# EAGLE design untitled (EAGLE 8.3.2)
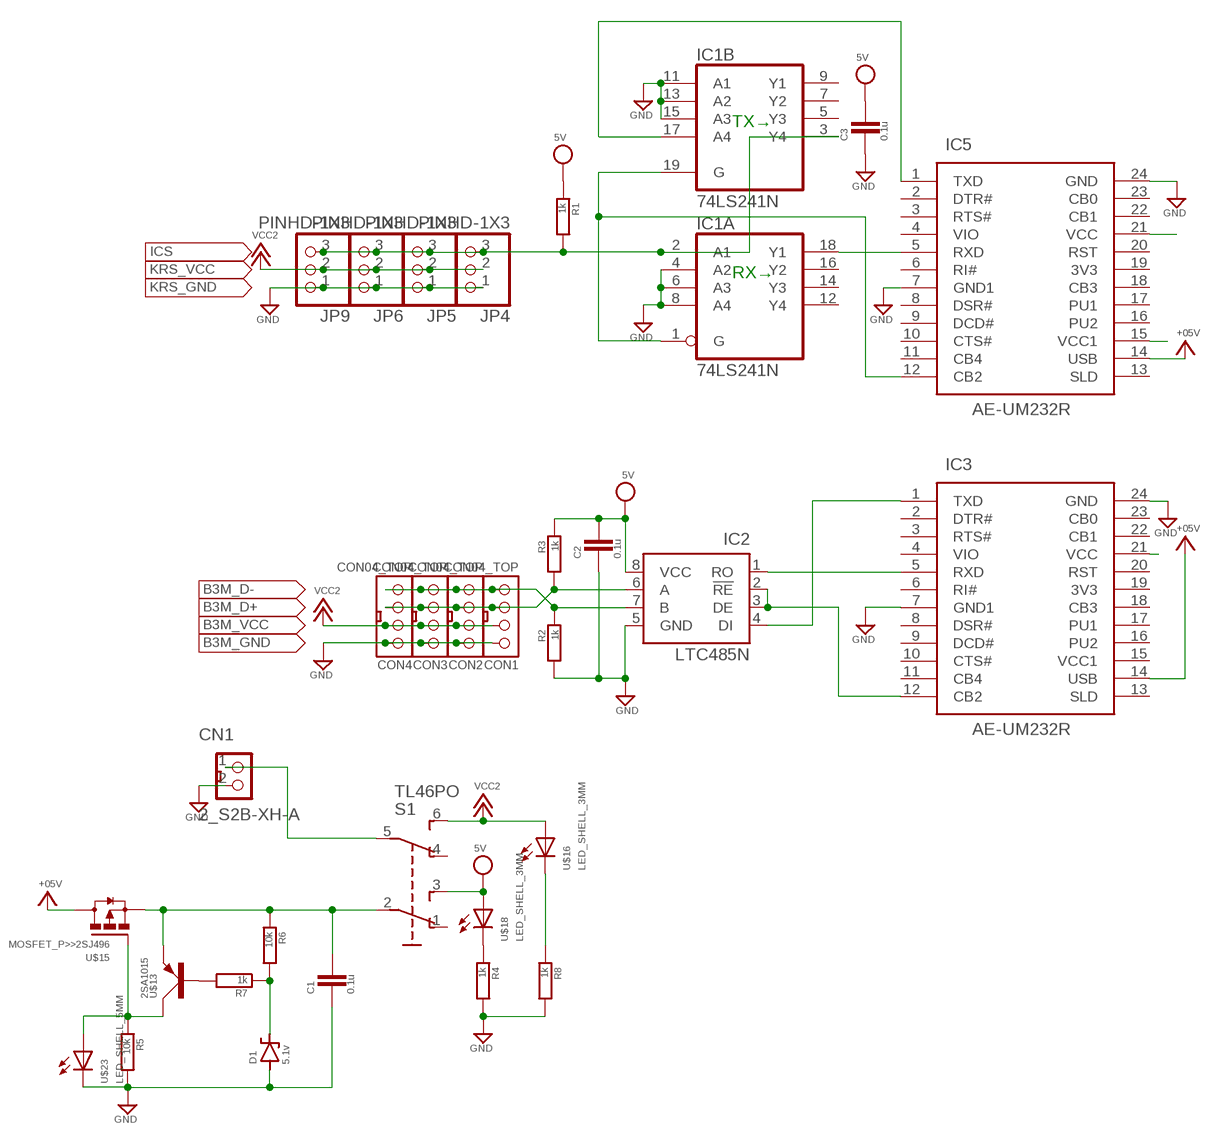
[diagram p0: schematic, sheet 1]

## Parts
C1  0.1u  C>>050-024X044  [C050-024X044]
C2  0.1u  C>>050-024X044  [C050-024X044]
C3  0.1u  C>>050-024X044  [C050-024X044]
CN1  2_S2B-XH-A  [S2B-XH-A]
CON1  CON04_TOP  [TOP_CON4]
CON2  CON04_TOP  [TOP_CON4]
CON3  CON04_TOP  [TOP_CON4]
CON4  CON04_TOP  [TOP_CON4]
D1  5.1v  ZENER-DIODE>>ZD-5  [ZDIO-5]
IC1  74LS241N  [DIL20]
IC2  LTC485N  [DIL08]
IC3  AE-UM232R  [AE-UM232R]
IC5  AE-UM232R  [AE-UM232R]
JP4  PINHD-1X3  [1X03]
JP5  PINHD-1X3  [1X03]
JP6  PINHD-1X3  [1X03]
JP9  PINHD-1X3  [1X03]
R1  1k  R-EU>>1/4W(8MM)  [1/4W(8MM)]
R2  1k  R-EU>>1/4W(8MM)  [1/4W(8MM)]
R3  1k  R-EU>>1/4W(8MM)  [1/4W(8MM)]
R4  1k  R-EU>>1/4W(8MM)  [1/4W(8MM)]
R5  10k  R-EU>>1/4W(8MM)  [1/4W(8MM)]
R6  10k  R-EU>>1/4W(8MM)  [1/4W(8MM)]
R7  1k  R-EU>>1/4W(8MM)  [1/4W(8MM)]
R8  1k  R-EU>>1/4W(8MM)  [1/4W(8MM)]
S1  TL46PO  [TL4XPO]
U$13  2SA1015  TR_PNP>>TO-92  [TO-92]
U$15  MOSFET_P>>2SJ496  [TO-92]
U$16  LED_SHELL_3MM  [3MM]
U$18  LED_SHELL_3MM  [3MM]
U$23  LED_SHELL_5MM  [5MM]

## Nets
+5V: IC3.14(USB) IC5.14(USB) U$15.2(D) ; supply symbol labelled +05V
GND: C1.2 C2.2 C3.2 CN1.2 CON1.P$1 CON2.P$1 CON3.P$1 CON4.P$1 D1.A IC1.4(A:A2) IC1.6(A:A3) IC1.8(A:A4) IC1.11(B:A1) IC1.13(B:A2) IC1.15(B:A3) IC2.5(GND) IC3.7(GND1) IC3.24(GND) IC5.7(GND1) IC5.24(GND) JP4.1 JP5.1 JP6.1 JP9.1 R2.2 R4.2 R5.2 R8.2 U$23.P$2(C)
ICS: IC1.2(A:A1) IC1.3(B:Y4) JP4.3 JP5.3 JP6.3 JP9.3 R1.2
N$1: IC1.18(A:Y1) IC5.5(RXD)
N$2: IC2.4(DI) IC3.1(TXD)
N$3: IC1.1(A:G) IC1.19(B:G) IC5.12(CB2)
N$4: IC5.21(VCC)
N$6: IC5.15(VCC1)
N$7: CN1.1 S1.5(P1)
N$8: C1.1 R6.1 S1.2(P) U$13.1(E) U$15.1(S)
N$9: R5.1 U$13.2(C) U$15.3(G) U$23.P$1(A)
N$10: D1.C R6.2 R7.1
N$11: R7.2 U$13.3(B)
N$13: R8.1 U$16.P$2(C)
N$15: R4.1 U$18.P$2(C)
N$16: IC3.21(VCC)
N$17: CON1.P$4 CON2.P$4 CON3.P$4 CON4.P$4 IC2.7(B) R2.1
N$18: CON1.P$3 CON2.P$3 CON3.P$3 CON4.P$3 IC2.6(A) R3.2
RXD: IC2.1(RO) IC3.5(RXD)
TXD: IC1.17(B:A4) IC5.1(TXD)
TXDEN: IC2.2(!RE) IC2.3(DE) IC3.12(CB2)
VCC: C2.1 C3.1 IC2.8(VCC) R1.1 R3.1 S1.3(S) U$18.P$1(A) ; supply symbol labelled 5V
VCC2: CON1.P$2 CON2.P$2 CON3.P$2 CON4.P$2 JP4.2 JP5.2 JP6.2 JP9.2 S1.6(S1) U$16.P$1(A)
Unconnected: IC1.5(B:Y3) IC1.7(B:Y2) IC1.9(B:Y1) IC1.12(A:Y4) IC1.14(A:Y3) IC1.16(A:Y2) IC3.2(DTR#) IC3.3(RTS#) IC3.4(VIO) IC3.6(RI#) IC3.8(DSR#) IC3.9(DCD#) IC3.10(CTS#) IC3.11(CB4) IC3.13(SLD) IC3.16(PU2) IC3.17(PU1) IC3.18(CB3) IC3.19(3V3) IC3.20(RST) IC3.22(CB1) IC3.23(CB0) IC5.2(DTR#) IC5.3(RTS#) IC5.4(VIO) IC5.6(RI#) IC5.8(DSR#) IC5.9(DCD#) IC5.10(CTS#) IC5.11(CB4) IC5.13(SLD) IC5.16(PU2) IC5.17(PU1) IC5.18(CB3) IC5.19(3V3) IC5.20(RST) IC5.22(CB1) IC5.23(CB0) S1.1(O) S1.4(O1)

## Notes on the sheet
- TX→
- RX→

## Power pins joined to a net without a drawn wire
GND: IC1.10(P:GND)
VCC: IC1.20(P:VCC)
VCC1: IC3.15(VCC1)

## Library data of the parts
C1-C3 = !Capasiter:C>>: CAPACITOR, European symbol
CN1 = !con-xh:2_: Wire-to-Board 2.5mm pitch top mount connector Source: http://www.jst-mfg.com/product/pdf/jpn/XH.pdf http://www.jst-mfg.com/product/detail.php?series=277
CON1-CON4 = !con_XH(XHｺﾈｸﾀ):CON04_: Low insertion connector 4pin
D1 = !diode(ﾀﾞｲｵｰﾄﾞ):ZENER-DIODE>>: Z-Diode
IC1 = 74xx-us:74*241: Octal BUFFER and LINE DRIVER, 3-state
IC2 = linear-technology:LTC485: Low Power RS485 Interface Transceiver Source: http://www.linear.com/pc/downloadDocument.do?navId=H0,C1,C1007,C1017,P2064,D1718; OC_FARNELL: unknown; OC_NEWARK: unknown
IC3 IC5 = !usb-usart:AE-UM232R: FT232RL USB-Serial Converter - AE-UM232R
JP4-JP6 JP9 = !pinhead(ﾋﾟﾝﾍｯﾀﾞ):PINHD-1X3: PIN HEADER
R1-R8 = !Resistor(抵抗):R-EU>>: RESISTOR, European symbol
S1 = switch:TL46PO: TINY SWITCH ON - ON Source: http://www2.produktinfo.conrad.com/datenblaetter/700000-724999/705152-da-01-de-Subminiaturschalter_TL_36YO.pdf
U$13 = !FET_transister_v-reg:TR_PNP>>
U$15 = !other:MOSFET_P>>
U$16 U$18 U$23 = !led:LED_SHELL

## Board
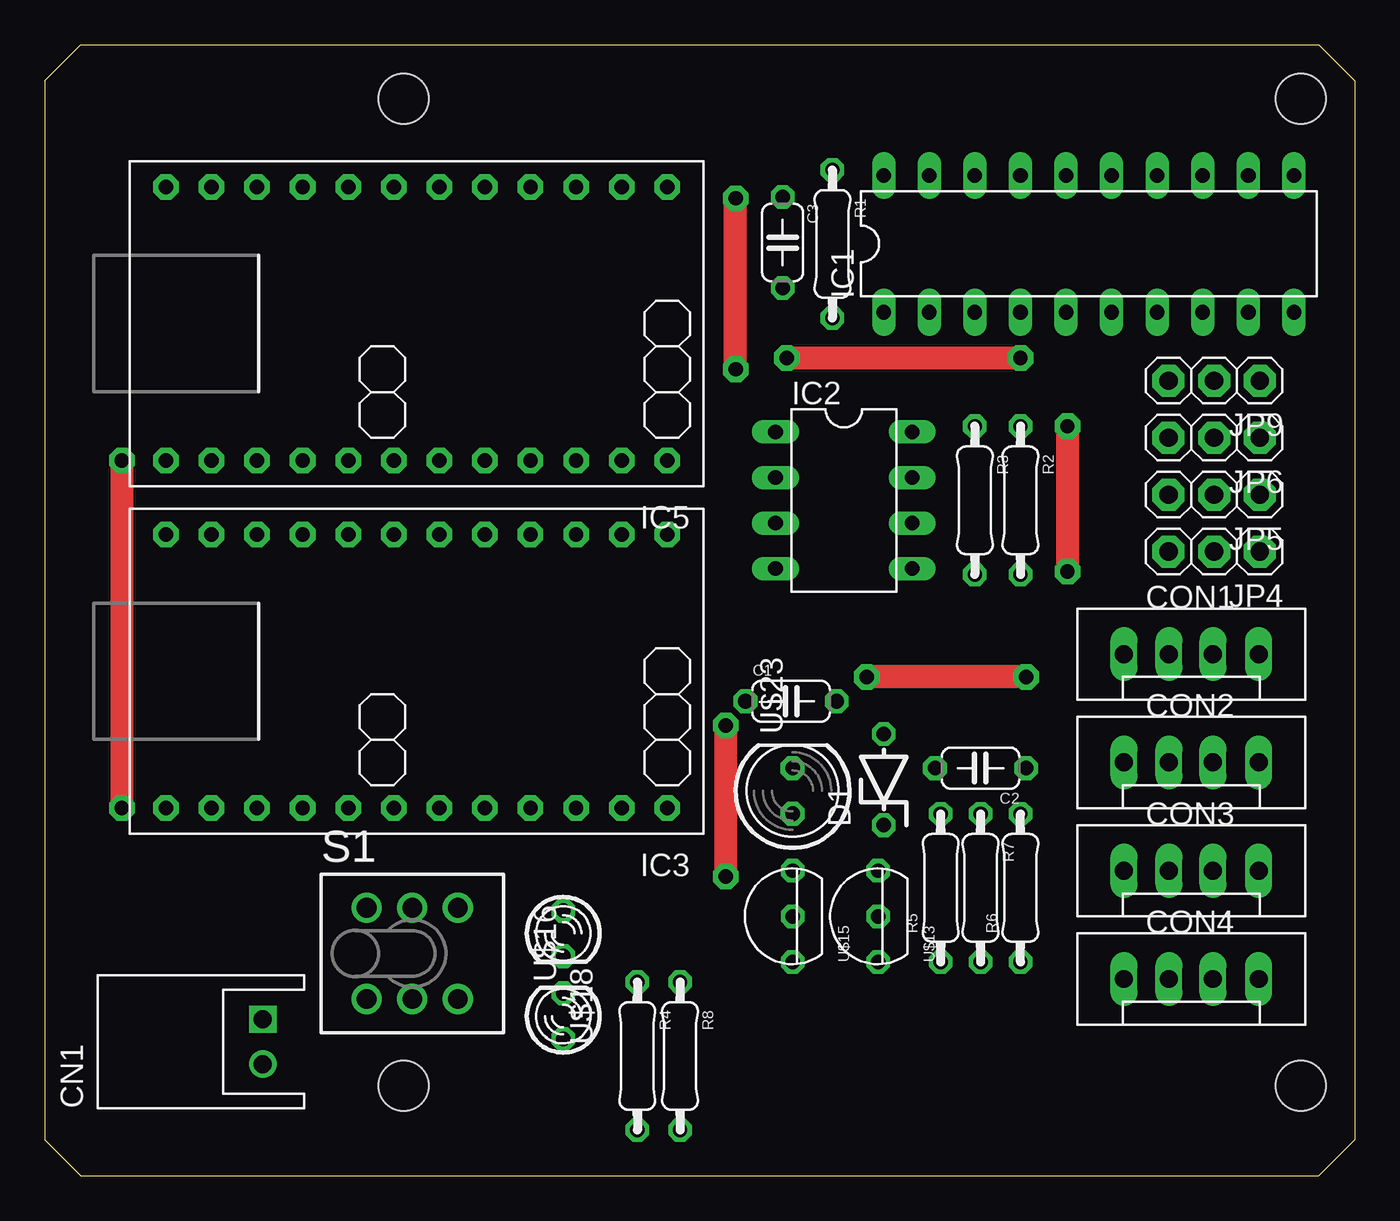
[diagram p1: board, top side]
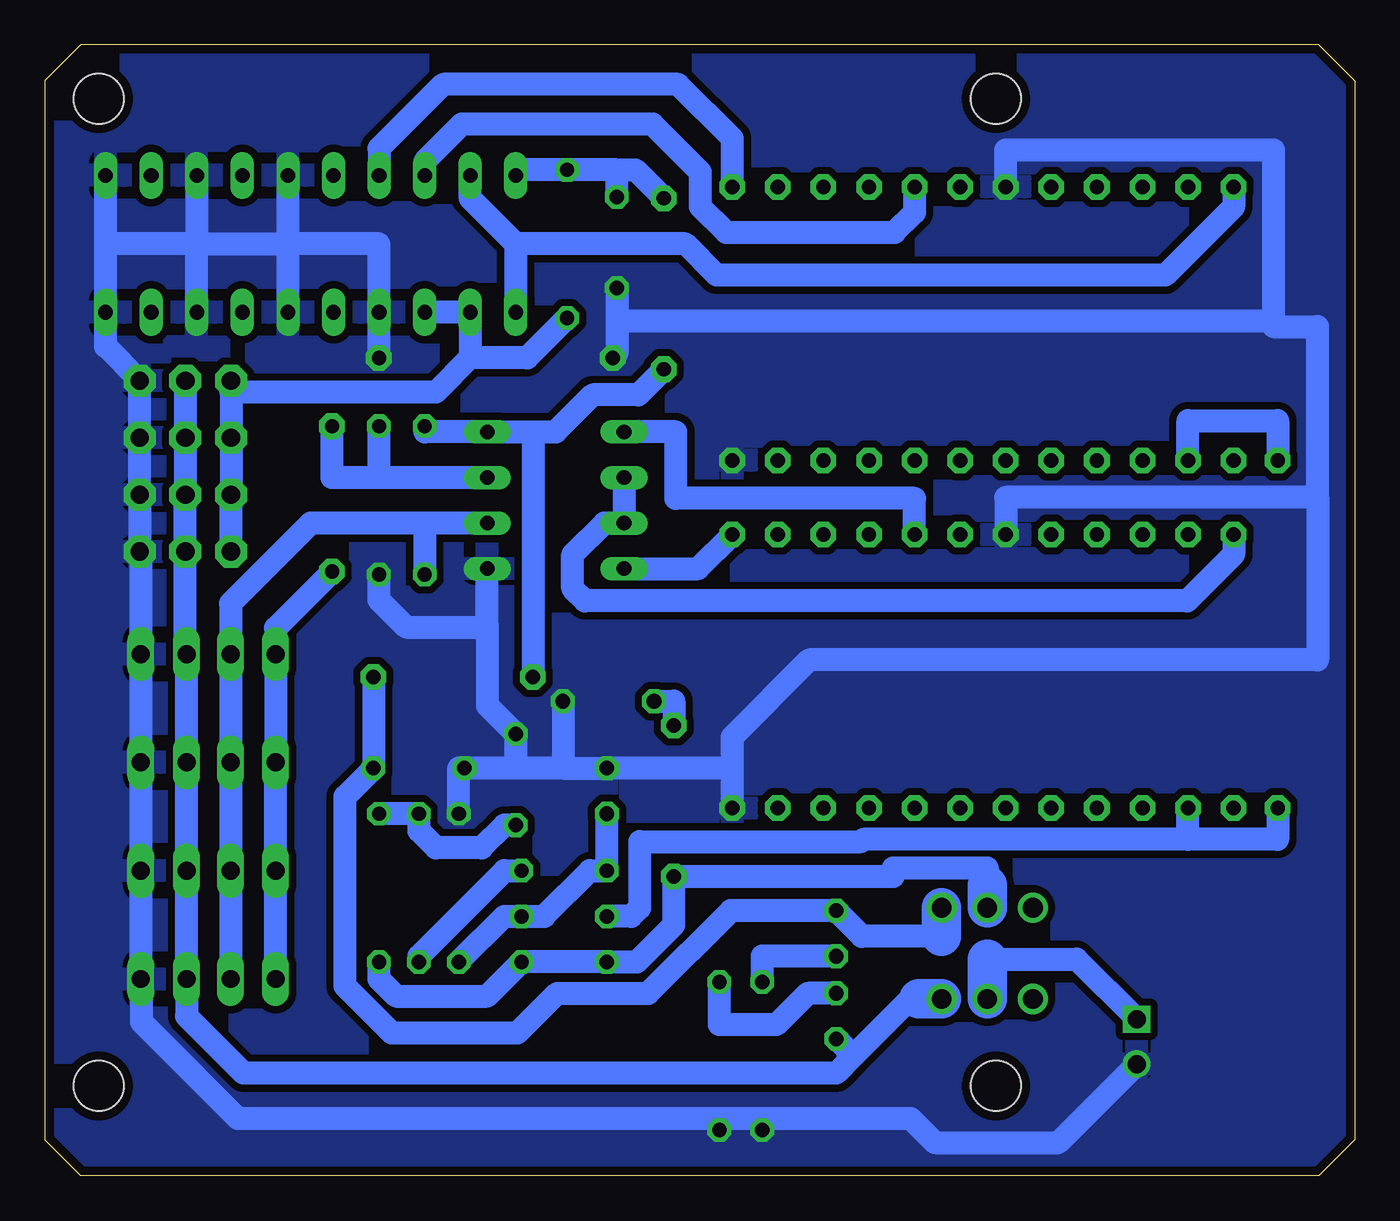
[diagram p2: board, bottom side, seen from below]

Size 73 x 63 mm. Coordinates in mm from the lower left corner, seen from the top.
Outline: 2,63 71,63 73,61 73,2 71,0 2,0 0,2 0,61 2,63
Copper layers (1*16): Top 0.035mm / dielectric 1.5mm / Bottom 0.035mm
Design rules "default *": minimum track width 24mil, minimum drill 0.8mm, track to track 8mil, track to pad 8mil, pad to pad 8mil, via to via 8mil, smd to smd 8mil, copper to edge 0.5mm, drill to drill 8mil, minimum pad ring 10mil, minimum via ring 8mil, stop-mask expansion 4mil, vias tented up to drill 0mil, thermal gap 10mil
Holes 2.8 mm at 20,5 70,5 20,60 70,60

### Footprints (pad centres in the part's own frame; a part is rotated, then mirrored left to right if it is on the bottom)
C050-024X044 = drill 0.813 octagon: 1 -2.54,0; 2 2.54,0
S2B-XH-A = drill 1.016 square: 1 1.25,0 | drill 1.016: 2 -1.25,0
TOP_CON4 = drill 1 long: P$1 3.75,0; P$2 1.2,0; P$3 -1.25,0; P$4 -3.75,0
ZDIO-5 = drill 0.813 octagon: A 2.54,0; C -2.54,0
DIL20 = drill 0.813 long: 1 -11.43,-3.81; 2 -8.89,-3.81; 3 -6.35,-3.81; 4 -3.81,-3.81; 5 -1.27,-3.81; 6 1.27,-3.81; 7 3.81,-3.81; 8 6.35,-3.81; 9 8.89,-3.81; 10 11.43,-3.81; 11 11.43,3.81; 12 8.89,3.81; 13 6.35,3.81; 14 3.81,3.81; 15 1.27,3.81; 16 -1.27,3.81; 17 -3.81,3.81; 18 -6.35,3.81; 19 -8.89,3.81; 20 -11.43,3.81
DIL08 = drill 0.813 long: 1 -3.81,-3.81; 2 -1.27,-3.81; 3 1.27,-3.81; 4 3.81,-3.81; 5 3.81,3.81; 6 1.27,3.81; 7 -1.27,3.81; 8 -3.81,3.81
AE-UM232R = drill 0.8 pad 1.422 octagon: 1 -13.97,-7.62; 2 -11.43,-7.62; 3 -8.89,-7.62; 4 -6.35,-7.62; 5 -3.81,-7.62; 6 -1.27,-7.62; 7 1.27,-7.62; 8 3.81,-7.62; 9 6.35,-7.62; 10 8.89,-7.62; 11 11.43,-7.62; 12 13.97,-7.62; 13 13.97,7.62; 14 11.43,7.62; 15 8.89,7.62; 16 6.35,7.62; 17 3.81,7.62; 18 1.27,7.62; 19 -1.27,7.62; 20 -3.81,7.62; 21 -6.35,7.62; 22 -8.89,7.62; 23 -11.43,7.62; 24 -13.97,7.62
1X03 = drill 1.016 pad 1.778 octagon: 1 -2.54,0; 2 0,0; 3 2.54,0
1/4W(8MM) = drill 0.8 pad 1.27 octagon: 1 -4.128,0; 2 4.128,0
TL4XPO = drill 1.1 pad 1.676: 1 -2.54,2.54; 2 0,2.54; 3 2.54,2.54; 4 -2.54,-2.54; 5 0,-2.54; 6 2.54,-2.54
TO-92 = drill 0.8 octagon: 1 -2.54,0; 2 0,0; 3 2.54,0
3MM = drill 0.813 octagon: P$1 -1.27,0; P$2 1.27,0
5MM = drill 0.813 octagon: P$1 -1.27,0; P$2 1.27,0

### Placement (x,y rotation side)
C1  41.59,26.43 0 top
C2  52.15,22.7 180 top
C3  41.12,51.99 270 top
CN1  12.14,7.46 90 top
CON1  63.9,29.05 0 top
CON2  63.9,23.02 0 top
CON3  63.9,16.99 0 top
CON4  63.9,10.96 0 top
D1  46.75,22.07 90 top
IC1  58.18,51.91 0 top
IC2  44.53,37.62 270 top
IC3  20.72,28.1 180 top
IC5  20.72,47.47 180 top
JP4  65.17,34.77 180 top
JP5  65.17,37.94 180 top
JP6  65.17,41.12 180 top
JP9  65.17,44.29 180 top
R1  43.9,51.91 270 top
R2  54.37,37.62 270 top
R3  51.83,37.62 270 top
R4  33.02,6.67 270 top
R5  49.93,16.04 90 top
R6  54.37,16.04 90 top
R7  52.15,16.04 270 top
R8  35.4,6.67 270 top
S1  20.48,12.38 0 top
U$13  46.44,14.45 90 top
U$15  41.67,14.45 90 top
U$16  28.89,8.89 90 top
U$18  28.89,13.49 270 top
U$23  41.67,21.43 90 top

### Tracks (layer width: path | path; a pad name or v marks a point on that pad's centre or on a via)
+5V  (via drill 0.8 pad 1.42)
  Top 1.27: v4.29,39.85 v4.29,20.48
  Bottom 1.27: U$15.2 40.32,14.45 39.85,14.92 39.85,18.61 27.5,18.61 27.39,18.73 9.29,18.73 | 9.29,18.73 IC3.14 | IC5.14 9.29,42.07 4.29,42.07 v4.29,39.85 | v4.29,20.48 4.29,18.73 9.29,18.73
GND  (via drill 0.8 pad 1.42)
  Top 1.27: v41.35,45.56 v54.37,45.56
  Bottom 1.27: 44.13,22.7 C2.2 | 44.13,22.7 U$23.P$2 34.69,22.7 | 59.45,51.91 54.37,51.91 IC1.4 v54.37,45.56 | 59.45,51.91 IC1.15 | 64.53,51.91 69.61,51.91 | 69.61,51.91 IC1.11 | 69.61,51.91 IC1.10 69.61,46.2 JP9.1 JP6.1 JP5.1 JP4.1 67.65,34.71 CON1.P$1 CON2.P$1 CON3.P$1 CON4.P$1 67.63,10.94 67.63,8.57 62.23,3.17 35.4,3.17 | IC1.6 59.45,51.91 | IC1.13 64.53,51.91 | IC1.8 64.53,51.91 | 64.53,51.91 59.45,51.91 | R2.2 54.37,32.07 52.87,30.56 48.42,30.56 48.34,30.64 | R5.2 49.93,22.7 C2.2 | C2.2 46.75,22.7 D1.A 48.34,26.2 48.34,30.64 | IC3.7 19.45,37.78 2.06,37.78 | 48.34,30.64 IC2.5 | 33.02,3.17 24.74,3.17 23.4,1.84 16.52,1.84 CN1.2 | 33.02,3.17 35.4,3.17 | 34.69,22.7 34.69,24.45 30.4,28.73 2.06,28.73 2.06,37.78 | 35.4,3.17 R8.2 | 33.02,3.17 R4.2 | C3.2 41.12,45.8 v41.35,45.56 | C1.2 44.13,22.7 | IC5.7 19.45,57.15 4.53,57.15 4.53,47.62 | IC3.24 34.69,22.7 | 4.53,47.62 4.53,47.31 2.06,47.31 2.06,37.78 | 40.72,47.62 4.53,47.62
  pour Bottom (isolate 0.406): -4.13,70.96 76.36,70.96 76.68,-2.86 -3.81,-2.86
ICS
  Bottom 1.27: 49.29,45.56 IC1.2 IC1.3 | R1.2 46.12,45.56 49.29,45.56 | JP4.3 JP5.3 JP6.3 | JP9.3 JP6.3 | 49.29,45.56 51.2,43.66 62.63,43.66 JP6.3
N$1
  Bottom 1.27: IC5.5 24.53,53.66 25.64,52.55 35.03,52.55 36.48,53.99 36.48,55.93 39.13,58.58 49.77,58.58 51.83,56.52 IC1.18
N$2
  Bottom 1.27: IC2.4 36.59,33.81 IC3.1
N$3
  Bottom 1.27: 46.75,51.91 IC1.1 | IC5.12 6.75,53.98 10.56,50.16 35.56,50.16 37.31,51.91 46.75,51.91 | 46.75,51.91 49.29,54.45 IC1.19
N$7
  Bottom 1.27: 20.48,12.06 15.5,12.06 CN1.1
  Bottom 2.2: S1.5 20.48,12.06
N$8  (via drill 0.8 pad 1.42)
  Top 1.27: v37.94,25.08 v37.94,16.67
  Bottom 1.27: R6.1 54.37,10.96 53.42,10 48.34,10 U$13.1 U$15.1 40,11.91 37.94,13.97 v37.94,16.67 25.72,16.67 25.72,17.14 20.48,17.14 20.48,16.19 | C1.1 37.94,26.43 v37.94,25.08
  Bottom 2.2: 20.48,16.19 S1.2
N$9
  Bottom 1.27: U$23.P$1 U$15.3 42.62,16.99 45.16,14.45 U$13.2 47.39,14.45 R5.1
N$10
  Bottom 1.27: R6.2 R7.1 52.15,19.21 51.2,18.26 48.66,18.26 47.39,19.53 D1.C
N$11
  Bottom 1.27: U$13.3 47.39,16.99 52.15,12.22 R7.2
N$13
  Bottom 1.27: U$16.P$2 30.48,10.16 32.23,8.41 35.4,8.41 R8.1
N$15
  Bottom 1.27: U$18.P$2 33.02,12.22 R4.1
N$17  (via drill 0.8 pad 1.42)
  Top 1.27: v56.99,41.75 v56.99,33.66
  Bottom 1.27: CON4.P$4 CON3.P$4 CON2.P$4 CON1.P$4 60.15,30.5 v56.99,33.66 | IC2.7 54.37,38.9 | 54.37,38.9 R2.1 | 54.37,38.9 56.99,38.9 v56.99,41.75
N$18
  Bottom 1.27: CON4.P$3 CON3.P$3 CON2.P$3 CON1.P$3 62.65,31.89 58.18,36.35 51.83,36.35 | IC2.6 51.83,36.35 | 51.83,36.35 R3.2
RXD
  Bottom 1.27: IC3.5 24.53,37.73 37.83,37.73 37.83,41.44 IC2.1
TXD
  Bottom 1.27: IC5.1 34.69,57.78 37.7,60.8 50.8,60.8 54.37,57.23 IC1.17
TXDEN
  Bottom 1.27: IC2.2 IC2.3 41.83,36.35 43.58,34.61 43.58,32.7 42.9,32.03 9.33,32.03 6.75,34.61 IC3.12
VCC  (via drill 0.8 pad 1.42)
  Top 1.27: v38.5,44.93 v38.5,54.45 | v54.69,27.78 v45.8,27.78
  Bottom 1.27: IC1.20 46.75,56.04 R1.1 41.12,56.04 | R3.1 51.83,41.44 IC2.8 45.8,41.44 | 45.8,41.44 44.53,41.44 42.47,43.5 39.93,43.5 v38.5,44.93 | v54.69,27.78 C2.1 56.28,21.11 56.28,10.56 53.66,7.94 46.67,7.94 44.45,10.16 39.37,10.16 34.77,14.76 U$18.P$1 27.46,13.34 23.02,13.34 | 23.02,14.76 S1.3 | v38.5,54.45 40.09,56.04 41.12,56.04 | C3.1 41.12,56.04 | 45.8,41.44 v45.8,27.78
  Bottom 2.2: S1.3 23.02,13.34
VCC2
  Bottom 1.27: JP9.2 JP6.2 JP5.2 JP4.2 65.17,29.12 CON1.P$2 CON2.P$2 CON3.P$2 CON4.P$2 65.1,8.89 61.92,5.71 28.89,5.71 28.02,6.59 | 24.29,9.84 24.77,9.84 28.02,6.59 | U$16.P$1 28.02,6.75 28.02,6.59
  Bottom 2.2: S1.6 24.29,9.84